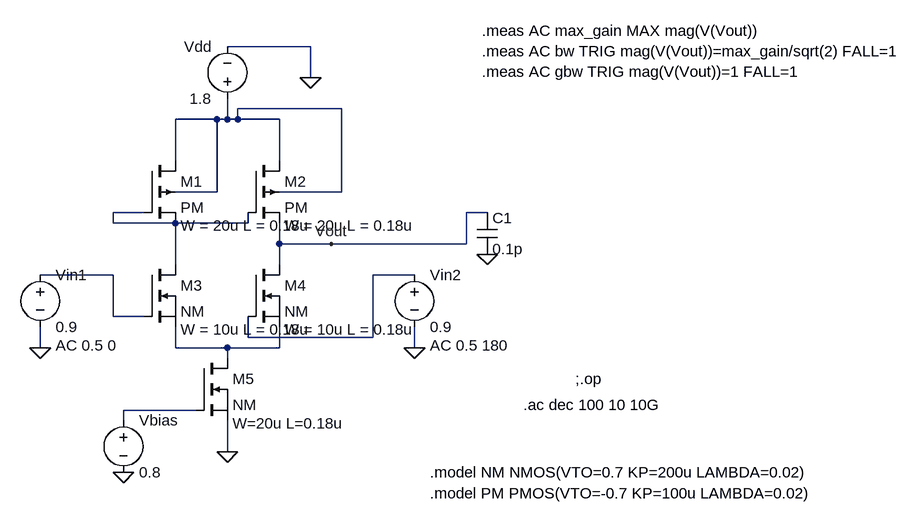
[diagram p0: schematic CMOS_differential_amplifier.asc]
CMOS_differential_amplifier.asc, the LTspice schematic file:
Version 4.1
SHEET 1 1340 680
WIRE 368 -112 240 -112
WIRE 368 -64 368 -112
WIRE 416 -16 256 -16
WIRE 224 0 160 0
WIRE 240 0 240 -32
WIRE 240 0 224 0
WIRE 256 0 256 -16
WIRE 256 0 240 0
WIRE 320 0 256 0
WIRE 160 64 160 0
WIRE 320 64 320 0
WIRE 224 112 224 0
WIRE 224 112 160 112
WIRE 416 112 416 -16
WIRE 416 112 320 112
WIRE 112 144 64 144
WIRE 640 144 608 144
WIRE 64 160 64 144
WIRE 160 160 64 160
WIRE 272 160 272 144
WIRE 272 160 160 160
WIRE 320 192 320 160
WIRE 400 192 320 192
WIRE 608 192 608 144
WIRE 608 192 400 192
WIRE 160 224 160 160
WIRE 320 224 320 192
WIRE 64 240 -48 240
WIRE 528 240 464 240
WIRE 64 304 64 240
WIRE 112 304 64 304
WIRE 272 336 272 304
WIRE 464 336 464 240
WIRE 464 336 272 336
WIRE -48 352 -48 320
WIRE 160 352 160 320
WIRE 240 352 160 352
WIRE 320 352 320 320
WIRE 320 352 240 352
WIRE 528 352 528 320
WIRE 240 368 240 352
WIRE 192 448 80 448
WIRE 80 464 80 448
WIRE 240 512 240 464
FLAG -48 352 0
FLAG 528 352 0
FLAG 400 192 Vout
FLAG 240 512 0
FLAG 80 544 0
FLAG 368 -64 0
FLAG 640 208 0
SYMBOL nmos 112 224 R0
WINDOW 39 56 100 Left 2
SYMATTR InstName M3
SYMATTR Value NM
SYMATTR SpiceLine W = 10u L = 0.18u
SYMBOL nmos 272 224 R0
WINDOW 39 56 100 Left 2
SYMATTR InstName M4
SYMATTR Value NM
SYMATTR SpiceLine W = 10u L = 0.18u
SYMBOL nmos 192 368 R0
WINDOW 39 56 100 Left 2
SYMATTR InstName M5
SYMATTR Value NM
SYMATTR SpiceLine W=20u L=0.18u
SYMBOL voltage -48 224 R0
WINDOW 123 24 124 Left 2
WINDOW 39 0 0 Left 0
SYMATTR InstName Vin1
SYMATTR Value 0.9
SYMATTR Value2 AC 0.5 0
SYMBOL voltage 528 224 R0
WINDOW 123 24 124 Left 2
WINDOW 39 0 0 Left 0
SYMATTR InstName Vin2
SYMATTR Value 0.9
SYMATTR Value2 AC 0.5 180
SYMBOL voltage 240 -16 R180
WINDOW 0 24 96 Left 2
WINDOW 3 24 16 Left 2
WINDOW 123 0 0 Left 0
WINDOW 39 0 0 Left 0
SYMATTR InstName Vdd
SYMATTR Value 1.8
SYMBOL voltage 80 448 R0
WINDOW 123 0 0 Left 0
WINDOW 39 0 0 Left 0
SYMATTR InstName Vbias
SYMATTR Value 0.8
SYMBOL pmos4 112 64 R0
WINDOW 39 56 100 Left 2
SYMATTR InstName M1
SYMATTR Value PM
SYMATTR SpiceLine W = 20u L = 0.18u
SYMBOL pmos4 272 64 R0
WINDOW 39 56 100 Left 2
SYMATTR InstName M2
SYMATTR Value PM
SYMATTR SpiceLine W = 20u L = 0.18u
SYMBOL cap 624 144 R0
SYMATTR InstName C1
SYMATTR Value 0.1p
TEXT 552 544 Left 2 !.model NM NMOS(VTO=0.7 KP=200u LAMBDA=0.02)
TEXT 552 576 Left 2 !.model PM PMOS(VTO=-0.7 KP=100u LAMBDA=0.02)
TEXT 776 400 Left 2 !;.op
TEXT 696 440 Left 2 !.ac dec 100 10 10G
TEXT 632 -136 Left 2 !.meas AC max_gain MAX mag(V(Vout))\n.meas AC bw TRIG mag(V(Vout))=max_gain/sqrt(2) FALL=1\n.meas AC gbw TRIG mag(V(Vout))=1 FALL=1

The netlist it stands for:
* CMOS_differential_amplifier.asc
M3 N002 N003 N005 N005 NM W = 10u L = 0.18u
M4 Vout N004 N005 N005 NM W = 10u L = 0.18u
M5 N005 N006 0 0 NM W=20u L=0.18u
Vin1 N003 0 0.9 AC 0.5 0
Vin2 N004 0 0.9 AC 0.5 180
Vdd N001 0 1.8
Vbias N006 0 0.8
M1 N001 N002 N002 N001 PM W = 20u L = 0.18u
M2 N001 N002 Vout N001 PM W = 20u L = 0.18u
C1 Vout 0 0.1p
.model NMOS NMOS
.model PMOS PMOS
.lib standard.mos
.model NM NMOS(VTO=0.7 KP=200u LAMBDA=0.02)
.model PM PMOS(VTO=-0.7 KP=100u LAMBDA=0.02)
;.op
.ac dec 100 10 10G
.meas AC max_gain MAX mag(V(Vout))
.meas AC bw TRIG mag(V(Vout))=max_gain/sqrt(2) FALL=1
.meas AC gbw TRIG mag(V(Vout))=1 FALL=1
.backanno
.end